# EAGLE schematic NSL_MiniQuad_2ndpass (EAGLE 5.10)

## Sheet 1 of 7
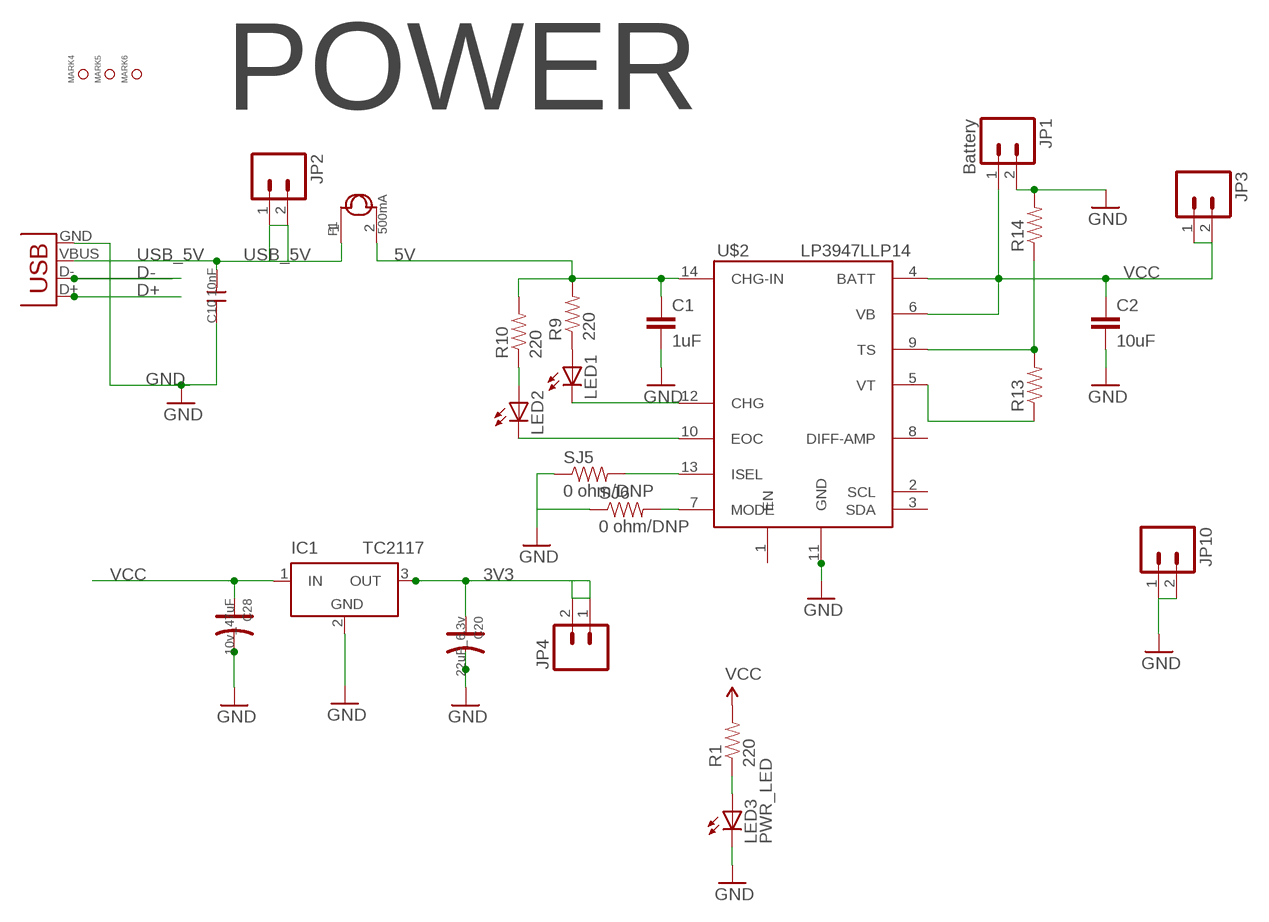
[diagram p0: schematic, sheet 1]

### Parts
C1  1uF  CAP0805  [0805]
C2  10uF  CAP0805  [0805]
C10  10nF  C-0805  [0805]
C20  22uF_6.3v  CAP_AVX_A  [AVX-A]
C28  10v_47uF  CAP_AVX_B  [AVX-B]
F1  500mA  FUSE-1206  [1206]
IC1  TC2117  LT1963EST-3.3  [SOT223]
JP1  Battery  M02POLAR  [MOLEX-1X2]
JP2  M021MM_MOTOR  [1MM_MOTOR]
JP3  M021MM_MOTOR  [1MM_MOTOR]
JP4  M021MM_MOTOR  [1MM_MOTOR]
JP10  M021MM_MOTOR  [1MM_MOTOR]
LED1  LEDCHIP-LED0603  [CHIP-LED0603]
LED2  LEDCHIP-LED0603  [CHIP-LED0603]
LED3  PWR_LED  LEDCHIP-LED0603  [CHIP-LED0603]
MARK4  DNP  PAD-MARK-30  [MARK_30]
MARK5  DNP  PAD-MARK-30  [MARK_30]
MARK6  DNP  PAD-MARK-30  [MARK_30]
R1  220  RESISTOR  [0805]
R9  220  RESISTOR  [0805]
R10  220  RESISTOR  [0805]
R13  RESISTOR  [0805]
R14  RESISTOR  [0805]
SJ5  0 ohm/DNP  RESISTOR0402-RES  [0402-RES]
SJ6  0 ohm/DNP  RESISTOR0402-RES  [0402-RES]
U$2  LP3947LLP14  [LLP14]
X1  USBSMD  [USB-MINIB]

### Nets
3V3: C20.+ IC1.3(OUT) JP4.1 JP4.2 ; also sheet 2,3,4,5
5V: C1.1 F1.2 R9.2 R10.2 U$2.14(CHG-IN) ; also sheet 3
D+: X1.D+ ; also sheet 3
D-: X1.D- ; also sheet 3
GND: C1.2 C2.2 C10.1 C20.- C28.- IC1.2(GND) JP1.2 JP10.1 JP10.2 LED3.C R14.2 SJ5.1 SJ6.1 U$2.11(GND) X1.GND ; also sheet 2,3,4,5,6
N$6: LED1.A R9.1
N$7: LED2.A R10.1
N$8: LED1.C U$2.12(CHG)
N$9: LED2.C U$2.10(EOC)
N$10: LED3.A R1.1
N$11: R13.1 U$2.5(VT)
N$12: R13.2 R14.1 U$2.9(TS)
N$27: SJ5.2 U$2.13(ISEL)
N$32: SJ6.2 U$2.7(MODE)
USB_5V: C10.2 F1.1 JP2.1 JP2.2 X1.VBUS
VCC: C2.1 C28.+ IC1.1(IN) JP1.1 JP3.1 JP3.2 R1.2 U$2.4(BATT) U$2.6(VB) ; also sheet 6
Unconnected: U$2.1(EN) U$2.2(SCL) U$2.3(SDA) U$2.8(DIFF-AMP)

### Notes on the sheet
- POWER

## Sheet 2 of 7
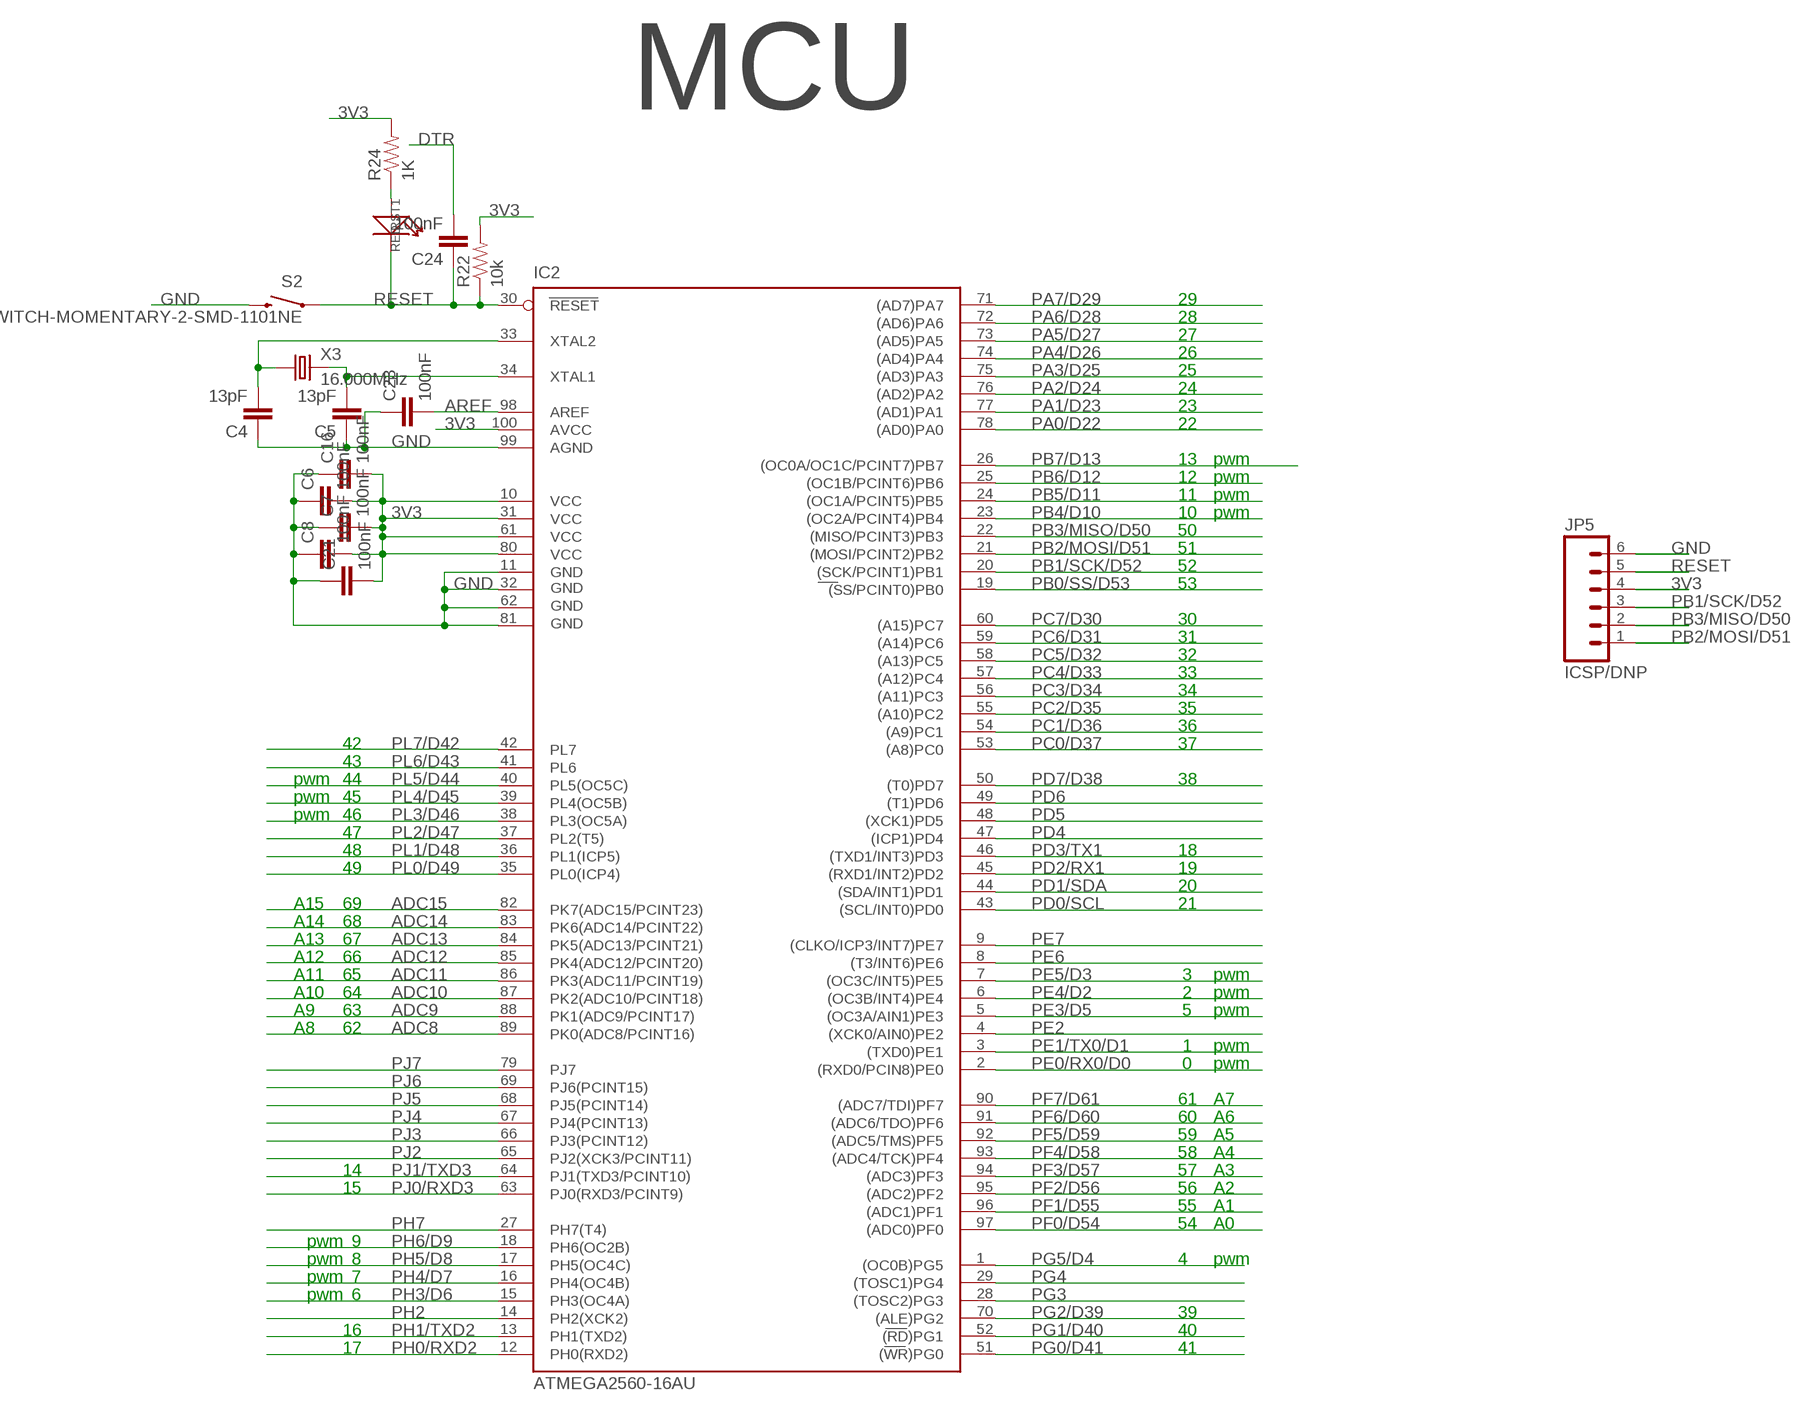
[diagram p1: schematic, sheet 2]

### Parts
C4  13pF  CAP0805  [0805]
C5  13pF  CAP0805  [0805]
C6  100nF  CAP0805  [0805]
C7  100nF  CAP0805  [0805]
C8  100nF  CAP0805  [0805]
C16  100nF  CAP0805  [0805]
C21  100nF  CAP0805  [0805]
C23  100nF  CAP0805  [0805]
C24  100nF  CAP0805  [0805]
IC2  ATMEGA2560-16AU  ATMEGA1280-16AU  [TQFP100]
JP5  ICSP/DNP  M061X06-SMD_EDGE_FEMALE  [1X06-SMD_EDGE]
R22  10k  RESISTOR  [0805]
R24  1K  RESISTOR  [0805]
RST1  RED  LED-0603  [D0603]
S2  SWITCH-MOMENTARY-2-SMD-1101NE  [TACTILE-SWITCH-1101NE]
X3  16.000MHz  CRYSTAL-5032  [5032]

### Nets
3V3: C6.2 C7.2 C8.2 C16.2 C21.2 IC2.10(VCC) IC2.31(VCC1) IC2.61(VCC2) IC2.80(VCC3) IC2.100(AVCC) JP5.4 R22.2 R24.2 ; also sheet 1,3,4,5
ADC8: IC2.89(PK0(ADC8/PCINT16))
ADC9: IC2.88(PK1(ADC9/PCINT17))
ADC10: IC2.87(PK2(ADC10/PCINT18))
ADC11: IC2.86(PK3(ADC11/PCINT19))
ADC12: IC2.85(PK4(ADC12/PCINT20))
ADC13: IC2.84(PK5(ADC13/PCINT21))
ADC14: IC2.83(PK6(ADC14/PCINT22))
ADC15: IC2.82(PK7(ADC15/PCINT23))
AREF: C23.2 IC2.98(AREF)
DTR: C24.2 ; also sheet 3
GND: C4.1 C5.1 C6.1 C7.1 C8.1 C16.1 C21.1 C23.1 IC2.11(GND) IC2.32(GND1) IC2.62(GND2) IC2.81(GND3) IC2.99(AGND) JP5.6 S2.P$2 ; also sheet 1,3,4,5,6
N$16: C5.2 IC2.34(XTAL1) X3.2
N$17: C4.2 IC2.33(XTAL2) X3.1
N$19: R24.1 RST1.+
PA0/D22: IC2.78((AD0)PA0)
PA1/D23: IC2.77((AD1)PA1)
PA2/D24: IC2.76((AD2)PA2)
PA3/D25: IC2.75((AD3)PA3)
PA4/D26: IC2.74((AD4)PA4)
PA5/D27: IC2.73((AD5)PA5)
PA6/D28: IC2.72((AD6)PA6)
PA7/D29: IC2.71((AD7)PA7)
PB0/SS/D53: IC2.19((SS/PCINT0)PB0)
PB1/SCK/D52: IC2.20((SCK/PCINT1)PB1) JP5.3
PB2/MOSI/D51: IC2.21((MOSI/PCINT2)PB2) JP5.1
PB3/MISO/D50: IC2.22((MISO/PCINT3)PB3) JP5.2
PB4/D10: IC2.23((OC2A/PCINT4)PB4)
PB5/D11: IC2.24((OC1A/PCINT5)PB5)
PB6/D12: IC2.25((OC1B/PCINT6)PB6)
PB7/D13: IC2.26((OC0A/OC1C/PCINT7)PB7)
PC0/D37: IC2.53((A8)PC0)
PC1/D36: IC2.54((A9)PC1)
PC2/D35: IC2.55((A10)PC2)
PC3/D34: IC2.56((A11)PC3)
PC4/D33: IC2.57((A12)PC4)
PC5/D32: IC2.58((A13)PC5)
PC6/D31: IC2.59((A14)PC6)
PC7/D30: IC2.60((A15)PC7)
PD0/SCL: IC2.43((SCL/INT0)PD0) ; also sheet 5
PD1/SDA: IC2.44((SDA/INT1)PD1) ; also sheet 5
PD2/RX1: IC2.45((RXD1/INT2)PD2) ; also sheet 4
PD3/TX1: IC2.46((TXD1/INT3)PD3) ; also sheet 4
PD4: IC2.47((ICP1)PD4)
PD5: IC2.48((XCK1)PD5)
PD6: IC2.49((T1)PD6)
PD7/D38: IC2.50((T0)PD7)
PE0/RX0/D0: IC2.2((RXD0/PCIN8)PE0) ; also sheet 3
PE1/TX0/D1: IC2.3((TXD0)PE1) ; also sheet 3
PE2: IC2.4((XCK0/AIN0)PE2)
PE3/D5: IC2.5((OC3A/AIN1)PE3) ; also sheet 6
PE4/D2: IC2.6((OC3B/INT4)PE4) ; also sheet 6
PE5/D3: IC2.7((OC3C/INT5)PE5) ; also sheet 6
PE6: IC2.8((T3/INT6)PE6)
PE7: IC2.9((CLKO/ICP3/INT7)PE7)
PF0/D54: IC2.97((ADC0)PF0)
PF1/D55: IC2.96((ADC1)PF1)
PF2/D56: IC2.95((ADC2)PF2)
PF3/D57: IC2.94((ADC3)PF3)
PF4/D58: IC2.93((ADC4/TCK)PF4)
PF5/D59: IC2.92((ADC5/TMS)PF5)
PF6/D60: IC2.91((ADC6/TDO)PF6)
PF7/D61: IC2.90((ADC7/TDI)PF7)
PG0/D41: IC2.51((WR)PG0) ; also sheet 5
PG1/D40: IC2.52((RD)PG1)
PG2/D39: IC2.70((ALE)PG2)
PG3: IC2.28((TOSC2)PG3)
PG4: IC2.29((TOSC1)PG4)
PG5/D4: IC2.1((OC0B)PG5) ; also sheet 6
PH0/RXD2: IC2.12(PH0(RXD2))
PH1/TXD2: IC2.13(PH1(TXD2))
PH2: IC2.14(PH2(XCK2))
PH3/D6: IC2.15(PH3(OC4A))
PH4/D7: IC2.16(PH4(OC4B))
PH5/D8: IC2.17(PH5(OC4C))
PH6/D9: IC2.18(PH6(OC2B))
PH7: IC2.27(PH7(T4))
PJ0/RXD3: IC2.63(PJ0(RXD3/PCINT9)) ; also sheet 5
PJ1/TXD3: IC2.64(PJ1(TXD3/PCINT10)) ; also sheet 5
PJ2: IC2.65(PJ2(XCK3/PCINT11))
PJ3: IC2.66(PJ3(PCINT12))
PJ4: IC2.67(PJ4(PCINT13))
PJ5: IC2.68(PJ5(PCINT14))
PJ6: IC2.69(PJ6(PCINT15))
PJ7: IC2.79(PJ7)
PL0/D49: IC2.35(PL0(ICP4))
PL1/D48: IC2.36(PL1(ICP5))
PL2/D47: IC2.37(PL2(T5))
PL3/D46: IC2.38(PL3(OC5A))
PL4/D45: IC2.39(PL4(OC5B))
PL5/D44: IC2.40(PL5(OC5C))
PL6/D43: IC2.41(PL6)
PL7/D42: IC2.42(PL7)
RESET: C24.1 IC2.30(RESET) JP5.5 R22.1 RST1.- S2.P$1

### Notes on the sheet
- MCU
- 29
- 28
- 27
- 26
- 25
- 24
- 23
- 22
- 13 | pwm
- 12 | pwm
- 11 | pwm
- 10 | pwm
- 50
- 51
- 52
- 53
- 30
- 31
- 32
- 33
- 34
- 35
- 36
- 42 | 37
- 43
- pwm | 44 | 38
- pwm | 45
- pwm | 46
- 47
- 48 | 18
- 49 | 19
- 20
- A15 | 69 | 21
- A14 | 68
- A13 | 67
- A12 | 66
- A11 | 65 | 3 | pwm
- A10 | 64 | 2 | pwm
- A9 | 63 | 5 | pwm
- A8 | 62
- 1 | pwm
- 0 | pwm
- 61 | A7
- 60 | A6
- 59 | A5
- 58 | A4
- 14 | 57 | A3
- 15 | 56 | A2
- 55 | A1
- 54 | A0
- pwm | 9
- pwm | 8 | 4 | pwm
- pwm | 7
- pwm | 6
- 39
- 16 | 40
- 17 | 41

## Sheet 3 of 7
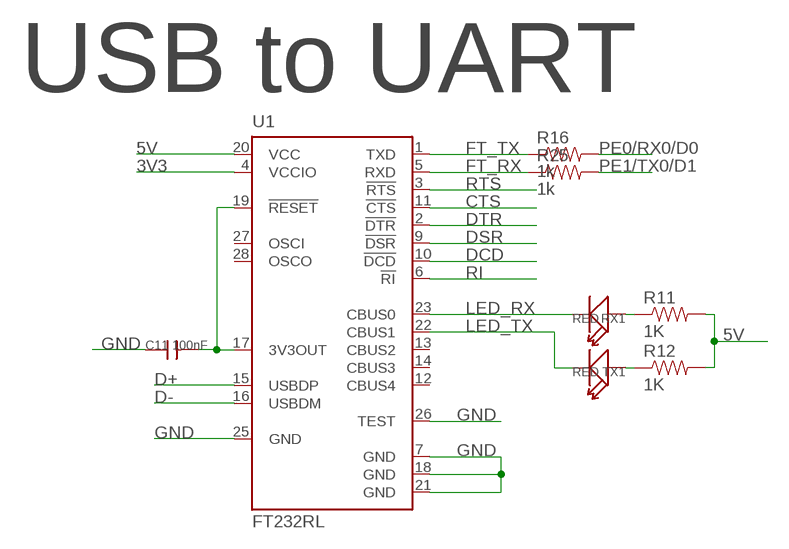
[diagram p2: schematic, sheet 3]

### Parts
C11  100nF  C-0805  [0805]
R11  1K  RESISTOR  [0805]
R12  1K  RESISTOR  [0805]
R16  1k  RESISTOR  [0805]
R25  1k  RESISTOR  [0805]
RX1  RED  LED-0603  [D0603]
TX1  RED  LED-0603  [D0603]
U1  FT232RL  [SSOP28]

### Nets
3V3: U1.4(VCCIO) ; also sheet 1,2,4,5
5V: R11.2 R12.2 U1.20(VCC) ; also sheet 1
CTS: U1.11(!CTS)
D+: U1.15(USBDP) ; also sheet 1
D-: U1.16(USBDM) ; also sheet 1
DCD: U1.10(!DCD)
DSR: U1.9(!DSR)
DTR: U1.2(!DTR) ; also sheet 2
FT_RX: R25.1 U1.5(RXD)
FT_TX: R16.1 U1.1(TXD)
GND: C11.1 U1.7(GND) U1.18(GND) U1.21(GND) U1.25(GND) U1.26(TEST) ; also sheet 1,2,4,5,6
LED_RX: RX1.- U1.23(CBUS0)
LED_TX: TX1.- U1.22(CBUS1)
N$2: C11.2 U1.17(3V3OUT) U1.19(!RESET)
N$3: R12.1 TX1.+
N$20: R11.1 RX1.+
PE0/RX0/D0: R16.2 ; also sheet 2
PE1/TX0/D1: R25.2 ; also sheet 2
RI: U1.6(!RI)
RTS: U1.3(!RTS)
Unconnected: U1.12(CBUS4) U1.13(CBUS2) U1.14(CBUS3) U1.27(OSCI) U1.28(OSCO)

### Notes on the sheet
- USB to UART

## Sheet 4 of 7
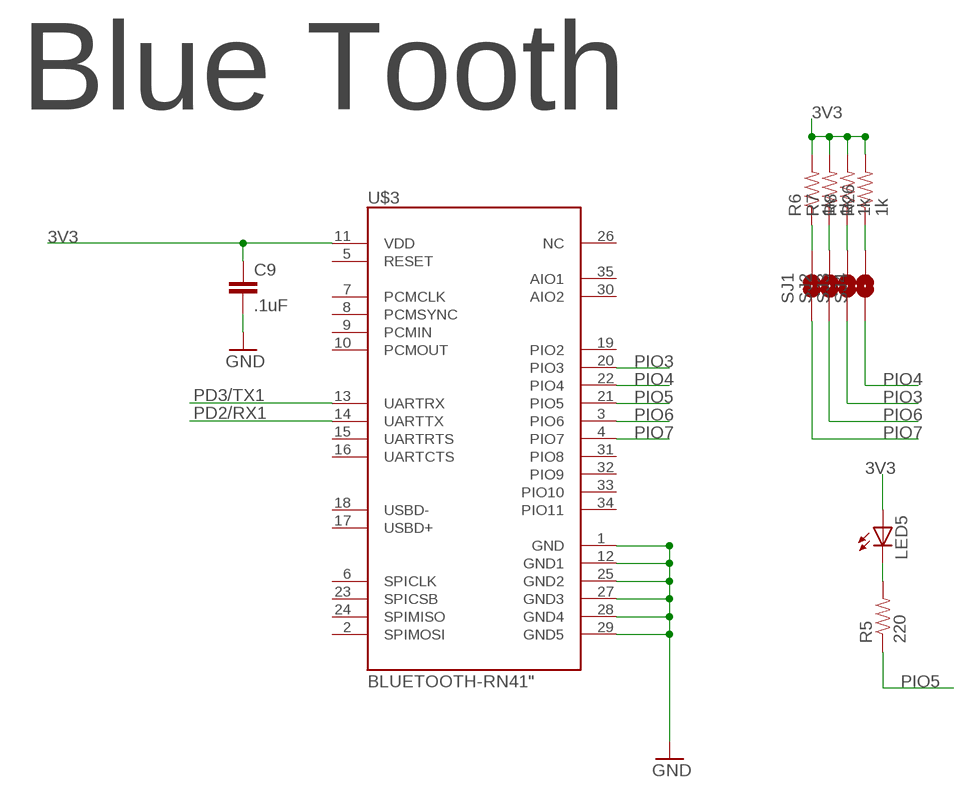
[diagram p3: schematic, sheet 4]

### Parts
C9  .1uF  CAP0805  [0805]
LED5  LEDCHIP-LED0603  [CHIP-LED0603]
R5  220  RESISTOR  [0805]
R6  1k  RESISTOR  [0805]
R7  1k  RESISTOR  [0805]
R8  1k  RESISTOR  [0805]
R26  1k  RESISTOR  [0805]
SJ1  SOLDERJUMPERNO  [SJ_2S-NO]
SJ2  SOLDERJUMPERNO  [SJ_2S-NO]
SJ3  SOLDERJUMPERNO  [SJ_2S-NO]
SJ4  SOLDERJUMPERNO  [SJ_2S-NO]
U$3  BLUETOOTH-RN41"  [RN41]

### Nets
3V3: C9.1 LED5.A R6.2 R7.2 R8.2 R26.2 U$3.11(VDD) ; also sheet 1,2,3,5
GND: C9.2 U$3.1(GND) U$3.12(GND1) U$3.25(GND2) U$3.27(GND3) U$3.28(GND4) U$3.29(GND5) ; also sheet 1,2,3,5,6
N$1: LED5.C R5.2
N$21: R8.1 SJ3.2
N$22: R6.1 SJ1.2
N$23: R7.1 SJ2.2
N$24: R26.1 SJ4.2
PD2/RX1: U$3.14(UARTTX) ; also sheet 2
PD3/TX1: U$3.13(UARTRX) ; also sheet 2
PIO3: SJ3.1 U$3.20(PIO3)
PIO4: SJ4.1 U$3.22(PIO4)
PIO5: R5.1 U$3.21(PIO5)
PIO6: SJ2.1 U$3.3(PIO6)
PIO7: SJ1.1 U$3.4(PIO7)
Unconnected: U$3.2(SPIMOSI) U$3.5(RESET) U$3.6(SPICLK) U$3.7(PCMCLK) U$3.8(PCMSYNC) U$3.9(PCMIN) U$3.10(PCMOUT) U$3.15(UARTRTS) U$3.16(UARTCTS) U$3.17(USBD+) U$3.18(USBD-) U$3.19(PIO2) U$3.23(SPICSB) U$3.24(SPIMISO) U$3.26(NC) U$3.30(AIO2) U$3.31(PIO8) U$3.32(PIO9) U$3.33(PIO10) U$3.34(PIO11) U$3.35(AIO1)

### Notes on the sheet
- Blue Tooth

## Sheet 5 of 7
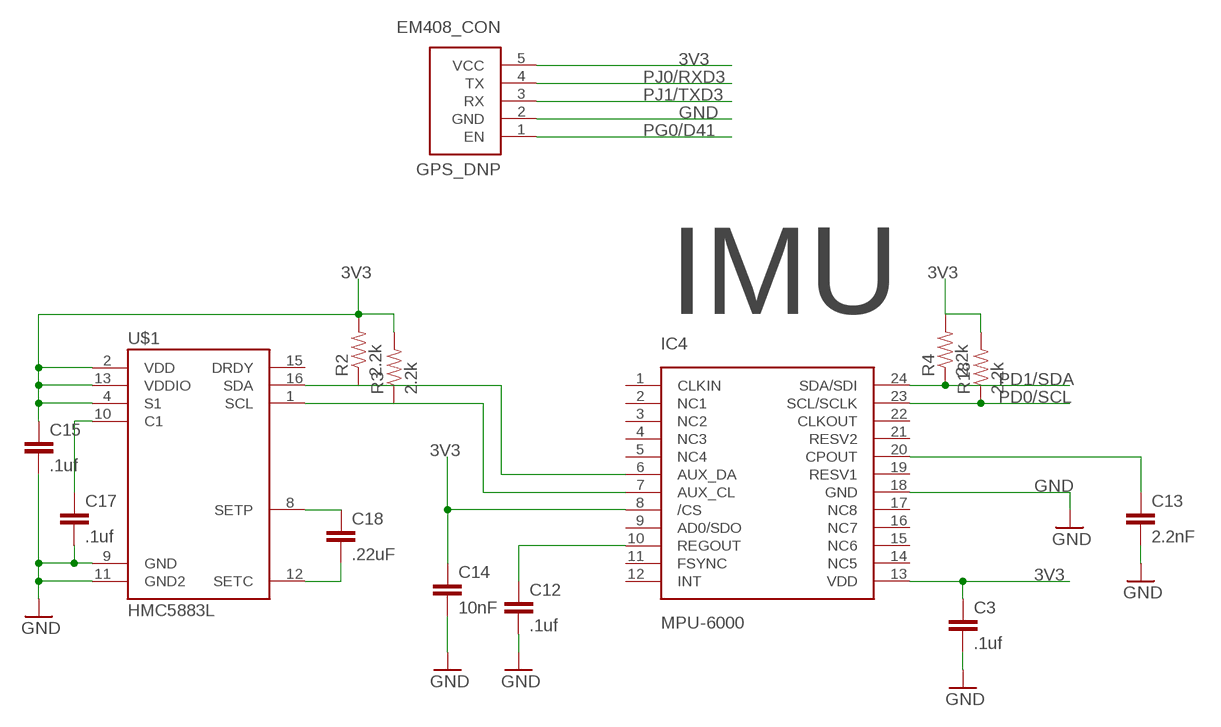
[diagram p4: schematic, sheet 5]

### Parts
C3  .1uf  CAP0805  [0805]
C12  .1uf  CAP0805  [0805]
C13  2.2nF  CAP0805  [0805]
C14  10nF  CAP0805  [0805]
C15  .1uf  CAP0805  [0805]
C17  .1uf  CAP0805  [0805]
C18  .22uF  CAP0805  [0805]
GPS_DNP  EM408_CON  [EM408_CON]
IC4  MPU-6000  [QFN-24]
R2  2.2k  RESISTOR  [0805]
R3  2.2k  RESISTOR  [0805]
R4  2.2k  RESISTOR  [0805]
R18  2.2k  RESISTOR  [0805]
U$1  HMC5883L  [LPCC16]

### Nets
3V3: C3.1 C14.1 C15.1 GPS_DNP.5(VCC) IC4.8(/CS) IC4.13(VDD) R2.2 R3.2 R4.2 R18.2 U$1.2(VDD) U$1.4(S1) U$1.13(VDDIO) ; also sheet 1,2,3,4
GND: C3.2 C12.2 C13.2 C14.2 C15.2 C17.2 GPS_DNP.2(GND) IC4.18(GND) U$1.9(GND) U$1.11(GND2) ; also sheet 1,2,3,4,6
N$15: C12.1 IC4.10(REGOUT)
N$18: C13.1 IC4.20(CPOUT)
N$25: IC4.6(AUX_DA) R2.1 U$1.16(SDA)
N$26: IC4.7(AUX_CL) R3.1 U$1.1(SCL)
N$34: C17.1 U$1.10(C1)
N$35: C18.1 U$1.8(SETP)
N$36: C18.2 U$1.12(SETC)
PD0/SCL: IC4.23(SCL/SCLK) R18.1 ; also sheet 2
PD1/SDA: IC4.24(SDA/SDI) R4.1 ; also sheet 2
PG0/D41: GPS_DNP.1(EN) ; also sheet 2
PJ0/RXD3: GPS_DNP.4(TX) ; also sheet 2
PJ1/TXD3: GPS_DNP.3(RX) ; also sheet 2
Unconnected: IC4.1(CLKIN) IC4.2(NC1) IC4.3(NC2) IC4.4(NC3) IC4.5(NC4) IC4.9(AD0/SDO) IC4.11(FSYNC) IC4.12(INT) IC4.14(NC5) IC4.15(NC6) IC4.16(NC7) IC4.17(NC8) IC4.19(RESV1) IC4.21(RESV2) IC4.22(CLKOUT) U$1.15(DRDY)

### Notes on the sheet
- IMU

## Sheet 6 of 7
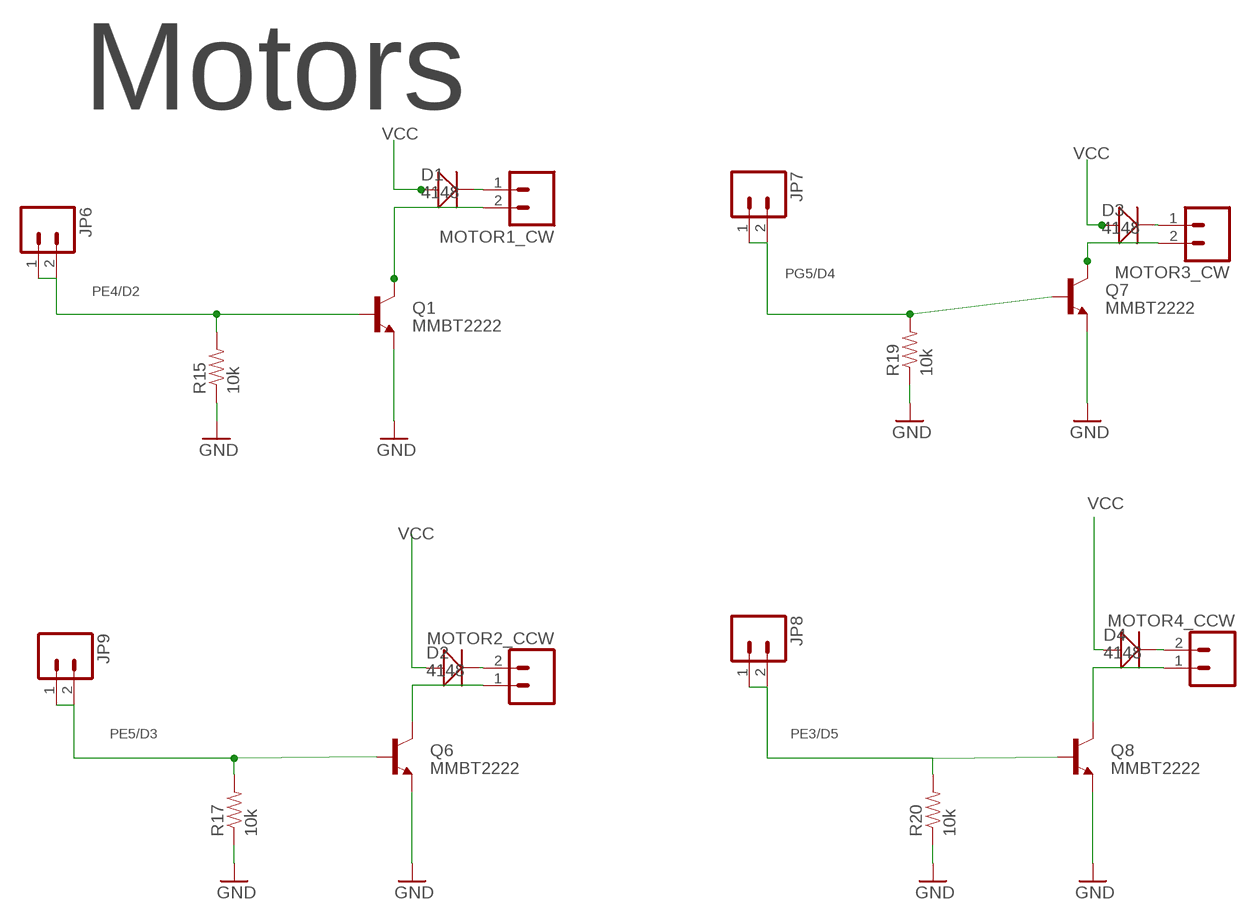
[diagram p5: schematic, sheet 6]

### Parts
D1  4148  D-SOD123  [SOD123]
D2  4148  D-SOD123  [SOD123]
D3  4148  D-SOD123  [SOD123]
D4  4148  D-SOD123  [SOD123]
JP6  M021MM_MOTOR  [1MM_MOTOR]
JP7  M021MM_MOTOR  [1MM_MOTOR]
JP8  M021MM_MOTOR  [1MM_MOTOR]
JP9  M021MM_MOTOR  [1MM_MOTOR]
MOTOR1_CW  M021MM_MOTOR  [1MM_MOTOR]
MOTOR2_CCW  M021MM_MOTOR  [1MM_MOTOR]
MOTOR3_CW  M021MM_MOTOR  [1MM_MOTOR]
MOTOR4_CCW  M021MM_MOTOR  [1MM_MOTOR]
Q1  MMBT2222  TRANSISTOR_NPNSOT23  [SOT23]
Q6  MMBT2222  TRANSISTOR_NPNSOT23  [SOT23]
Q7  MMBT2222  TRANSISTOR_NPNSOT23  [SOT23]
Q8  MMBT2222  TRANSISTOR_NPNSOT23  [SOT23]
R15  10k  RESISTOR  [0805]
R17  10k  RESISTOR  [0805]
R19  10k  RESISTOR  [0805]
R20  10k  RESISTOR  [0805]

### Nets
GND: Q1.2(E) Q6.2(E) Q7.2(E) Q8.2(E) R15.1 R17.1 R19.1 R20.1 ; also sheet 1,2,3,4,5
N$4: D1.- MOTOR1_CW.1
N$5: D2.- MOTOR2_CCW.2
N$13: D3.- MOTOR3_CW.1
N$14: D4.- MOTOR4_CCW.2
N$28: MOTOR2_CCW.1 Q6.3(C)
N$29: MOTOR1_CW.2 Q1.3(C)
N$30: MOTOR3_CW.2 Q7.3(C)
N$31: MOTOR4_CCW.1 Q8.3(C)
PE3/D5: JP8.1 JP8.2 Q8.1(B) R20.2 ; also sheet 2
PE4/D2: JP6.1 JP6.2 Q1.1(B) R15.2 ; also sheet 2
PE5/D3: JP9.1 JP9.2 Q6.1(B) R17.2 ; also sheet 2
PG5/D4: JP7.1 JP7.2 Q7.1(B) R19.2 ; also sheet 2
VCC: D1.+ D2.+ D3.+ D4.+ ; also sheet 1

### Notes on the sheet
- Motors

## Sheet 7 of 7
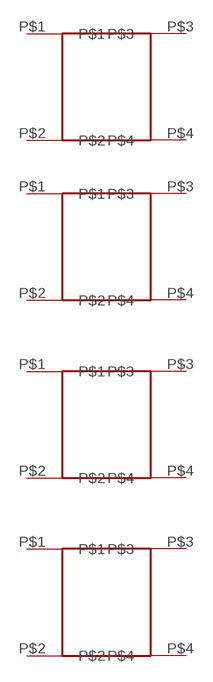
[diagram p6: schematic, sheet 7]

### Parts
U$8  SLOT  [SLOT]
U$9  SLOT  [SLOT]
U$10  SLOT  [SLOT]
U$11  SLOT  [SLOT]
Unconnected: U$8.P$1 U$8.P$2 U$8.P$3 U$8.P$4 U$9.P$1 U$9.P$2 U$9.P$3 U$9.P$4 U$10.P$1 U$10.P$2 U$10.P$3 U$10.P$4 U$11.P$1 U$11.P$2 U$11.P$3 U$11.P$4

## Power pins joined to a net without a drawn wire
GND: IC1.4(GND)

## Library data of the parts
C1-C9 C12-C18 C21 C23 C24 = SparkFun:CAP: Capacitor Standard 0603 ceramic capacitor, and 0.1" leaded capacitor.
C10 C11 = Discrete:C*: Ceramic Capacitors
C20 C28 = Discrete:CAP*: Electrolytic Capacitors,Tantalum Capacitors and Super Capacitors
D1-D4 = NSL_MiniQuad:D*
F1 = Discrete:FUSE
GPS_DNP = SparkFun:EM408_CON: This is the mating connector for the EM408 GPS receiver. The EM408 connects to the board via a cable, this connector footprint does not include the outline of the receiver. You should include the "EM408_Outline" device in your schematic if you are to use the EM408 in your design.
IC1 = linear-technology:LT1963EST: 1.5A, Low Noise, Fast Transient Response LDO Regulator Source: http://www.linear.com/pc/downloadDocument.do?navId=H0,C3,P2222,D3148
IC2 = ICs_v54:ATMEGA*: MICROCONTROLLER 64/128/256 Kbytes FLASH 4 Kbytes EEPROM 8 Kbytes SRAM 86 General Purpose I/O pins 12-channels16-bit PWM 4 x Serial USARTs 16-channels 10-bit A/D
IC4 = NSL_MiniQuad:MPU-6000: Invensense MPU-6000: 3-axis gyro, 3-axis accel & 9-axis MotionFusion The MPU-60X0 Motion Processing Unit (MPU?) is the world?s first motion processing solution with integrated 9-axis sensor fusion for handset and tablet applications, game controllers, motion pointer remote controls, and other consumer devices. The MPU-60X0 has an embedded 3-axis MEMS gyroscope, 3-axis MEMS accelerometer and Digital Motion Processor? (DMP) hardware accelerator engine with an auxiliary I 2 C port that interfaces to third party digital sensors, such as magnetometers. Interfacing with a 3-axis magnetometer delivers a complete 9-axis sensor fusion output to the MPU?s primary I 2 C or SPI port. (SPI is available on MPU-6000 only). This combines acceleration and rotational motion plus heading information into a single data stream for the application; DATASHEET: http://invensense.com/mems/gyro/documents/PS-MPU-6000A-00_v1.0.pdf; LINK: http://invensense.com/mems/gyro/mpu6000.html; MFGPN: MPU-6000
JP1 = SparkFun:M02: Header 2 Standard 2-pin 0.1" header. Use with straight break away headers (SKU : PRT-00116), right angle break away headers (PRT-00553), swiss pins (PRT-00743), machine pins (PRT-00117), and female headers (PRT-00115). Molex polarized connector foot print use with SKU : PRT-08233 with associated crimp pins and housings.
JP2-JP4 JP6-JP10 MOTOR1_CW MOTOR2_CCW MOTOR3_CW MOTOR4_CCW = NSL_MiniQuad:M02: Header 2 Standard 2-pin 0.1" header. Use with straight break away headers (SKU : PRT-00116), right angle break away headers (PRT-00553), swiss pins (PRT-00743), machine pins (PRT-00117), and female headers (PRT-00115). Molex polarized connector foot print use with SKU : PRT-08233 with associated crimp pins and housings.
JP5 = SparkFun:M06: Header 6 Standard 6-pin 0.1" header. Use with straight break away headers (SKU : PRT-00116), right angle break away headers (PRT-00553), swiss pins (PRT-00743), machine pins (PRT-00117), and female headers (PRT-00115). Molex polarized connector foot print use with SKU : PRT-08094 with associated crimp pins and housings. NOTES ON THE VARIANTS LOCK and LOCK_LONGPADS... This footprint was designed to help hold the alignment of a through-hole component (i.e. 6-pin header) while soldering it into place. You may notice that each hole has been shifted either up or down by 0.005 of an inch from it's more standard position (which is a perfectly straight line). This slight alteration caused the pins (the squares in the middle) to touch the edges of the holes. Because they are alternating, it causes a "brace" to hold the component in place. 0.005 has proven to be the perfect amount of "off-center" position when using our standard breakaway headers. Although looks a little odd when you look at the bare footprint, once you have a header in there, the alteration is very hard to notice. Also, if you push a header all the way into place, it is covered up entirely on the bottom side. This idea of altering the position of holes to aid alignment will be further integrated into the Sparkfun Library for other footprints. It can help hold any component with 3 or more connection pins.
LED1-LED3 LED5 = led:LED: LED OSRAM: - CHIPLED LG R971, LG N971, LY N971, LG Q971, LY Q971, LO R971, LY R971 LH N974, LH R974 LS Q976, LO Q976, LY Q976 LO Q996 - Hyper CHIPLED LW Q18S LB Q993, LB Q99A, LB R99A - SideLED LS A670, LO A670, LY A670, LG A670, LP A670 LB A673, LV A673, LT A673, LW A673 LH A674 LY A675 LS A676, LA A676, LO A676, LY A676, LW A676 LS A679, LY A679, LG A679 - Hyper Micro SIDELED® LS Y876, LA Y876, LO Y876, LY Y876 LT Y87S - SmartLED LW L88C, LW L88S LB L89C, LB L89S, LG L890 LS L89K, LO L89K, LY L89K LS L896, LA L896, LO L896, LY L896 - TOPLED LS T670, LO T670, LY T670, LG T670, LP T670 LSG T670, LSP T670, LSY T670, LOP T670, LYG T670 LG T671, LOG T671, LSG T671 LB T673, LV T673, LT T673, LW T673 LH T674 LS T676, LA T676, LO T676, LY T676, LB T676, LH T676, LSB T676, LW T676 LB T67C, LV T67C, LT T67C, LS T67K, LO T67K, LY T67K, LW E67C LS E67B, LA E67B, LO E67B, LY E67B, LB E67C, LV E67C, LT E67C LW T67C LS T679, LY T679, LG T679 LS T770, LO T770, LY T770, LG T770, LP T770 LB T773, LV T773, LT T773, LW T773 LH T774 LS E675, LA E675, LY E675, LS T675 LS T776, LA T776, LO T776, LY T776, LB T776 LHGB T686 LT T68C, LB T68C - Hyper Mini TOPLED® LB M676 - Mini TOPLED Santana® LG M470 LS M47K, LO M47K, LY M47K Source: http://www.osram.convergy.de LUXEON: - LUMILED® LXK2-PW12-R00, LXK2-PW12-S00, LXK2-PW14-U00, LXK2-PW14-V00 LXK2-PM12-R00, LXK2-PM12-S00, LXK2-PM14-U00 LXK2-PE12-Q00, LXK2-PE12-R00, LXK2-PE12-S00, LXK2-PE14-T00, LXK2-PE14-U00 LXK2-PB12-K00, LXK2-PB12-L00, LXK2-PB12-M00, LXK2-PB14-N00, LXK2-PB14-P00, LXK2-PB14-Q00 LXK2-PR12-L00, LXK2-PR12-M00, LXK2-PR14-Q00, LXK2-PR14-R00 LXK2-PD12-Q00, LXK2-PD12-R00, LXK2-PD12-S00 LXK2-PH12-R00, LXK2-PH12-S00 LXK2-PL12-P00, LXK2-PL12-Q00, LXK2-PL12-R00 Source: www.luxeon.com KINGBRIGHT: KA-3528ASYC Source: www.kingbright.com
MARK4-MARK6 = Discrete:PAD-MARK
Q1 Q6-Q8 = SparkFun:TRANSISTOR_NPN: Transistor NPN BJT configuration in SOT23 package. MMBT2222 is the common NPN we use. Double check BCE configuration again layout.
R1-R20 R22 R24-R26 = SparkFun:RESISTOR: Resistor Basic schematic elements and footprints for 0603, 1206, and PTH 1/10th watt (small) resistors.
RST1 RX1 TX1 = Discrete:LED*
S2 = SparkFun:SWITCH-MOMENTARY-2
SJ1-SJ4 = SparkFun:SOLDERJUMPER: Solder Jumper Standard SMD solder jumper. Used to automate production. Two varients : Normally Open and Normally Closed are the same, but have different paste layers. NC will have a large amount of paste and should jumper during reflow.
SJ5 SJ6 = NSL_MiniQuad:RESISTOR: Resistor Basic schematic elements and footprints for 0603, 1206, and PTH 1/10th watt (small) resistors.
U1 = ICs_v54:FT232R: Source: http://www.ftdichip.com/Documents/DataSheets/DS_FT232R_v104.pdf
U$1 = 3DRobotics_Master_Library:HMC5883L: Honeywell HMC5883L 3-axis digital compass IC Successor to the HMC5843.; DATASHEET: http://www.dsscircuits.com/images/datasheets/HMC5883L.pdf; LINK: http://parts.digikey.com/1/parts/2057013-ic-compass-3-axis-i2c-16lcc-smd-hmc5883l-tr.html; MFGPN: HMC5883L-TR
U$2 = NSL_MiniQuad:LP3947
U$3 = NSL_Mini_Quad:BLUETOOTH-RN41
U$8-U$11 = NSL_MiniQuad:SLOT
X1 = SparkFun:USB: USB Connectors USB-B-PTH is fully proven SKU : PRT-00139 USB-miniB is fully proven SKU : PRT-00587 USB-A-PCB is untested. USB-A-H is throughly reviewed, but untested. Spark Fun Electronics SKU : PRT-00437 USB-B-SMT is throughly reviewed, but untested. Needs silkscreen touching up. USB-A-S has not been used/tested USB-MB-H has not been used/tested
X3 = NSL_MiniQuad:CRYSTAL*: CRYSTAL